# Altium schematic sheet 06-Si5341_PLL.SchDoc
size B; SheetNumber: 6; SheetTotal: 12
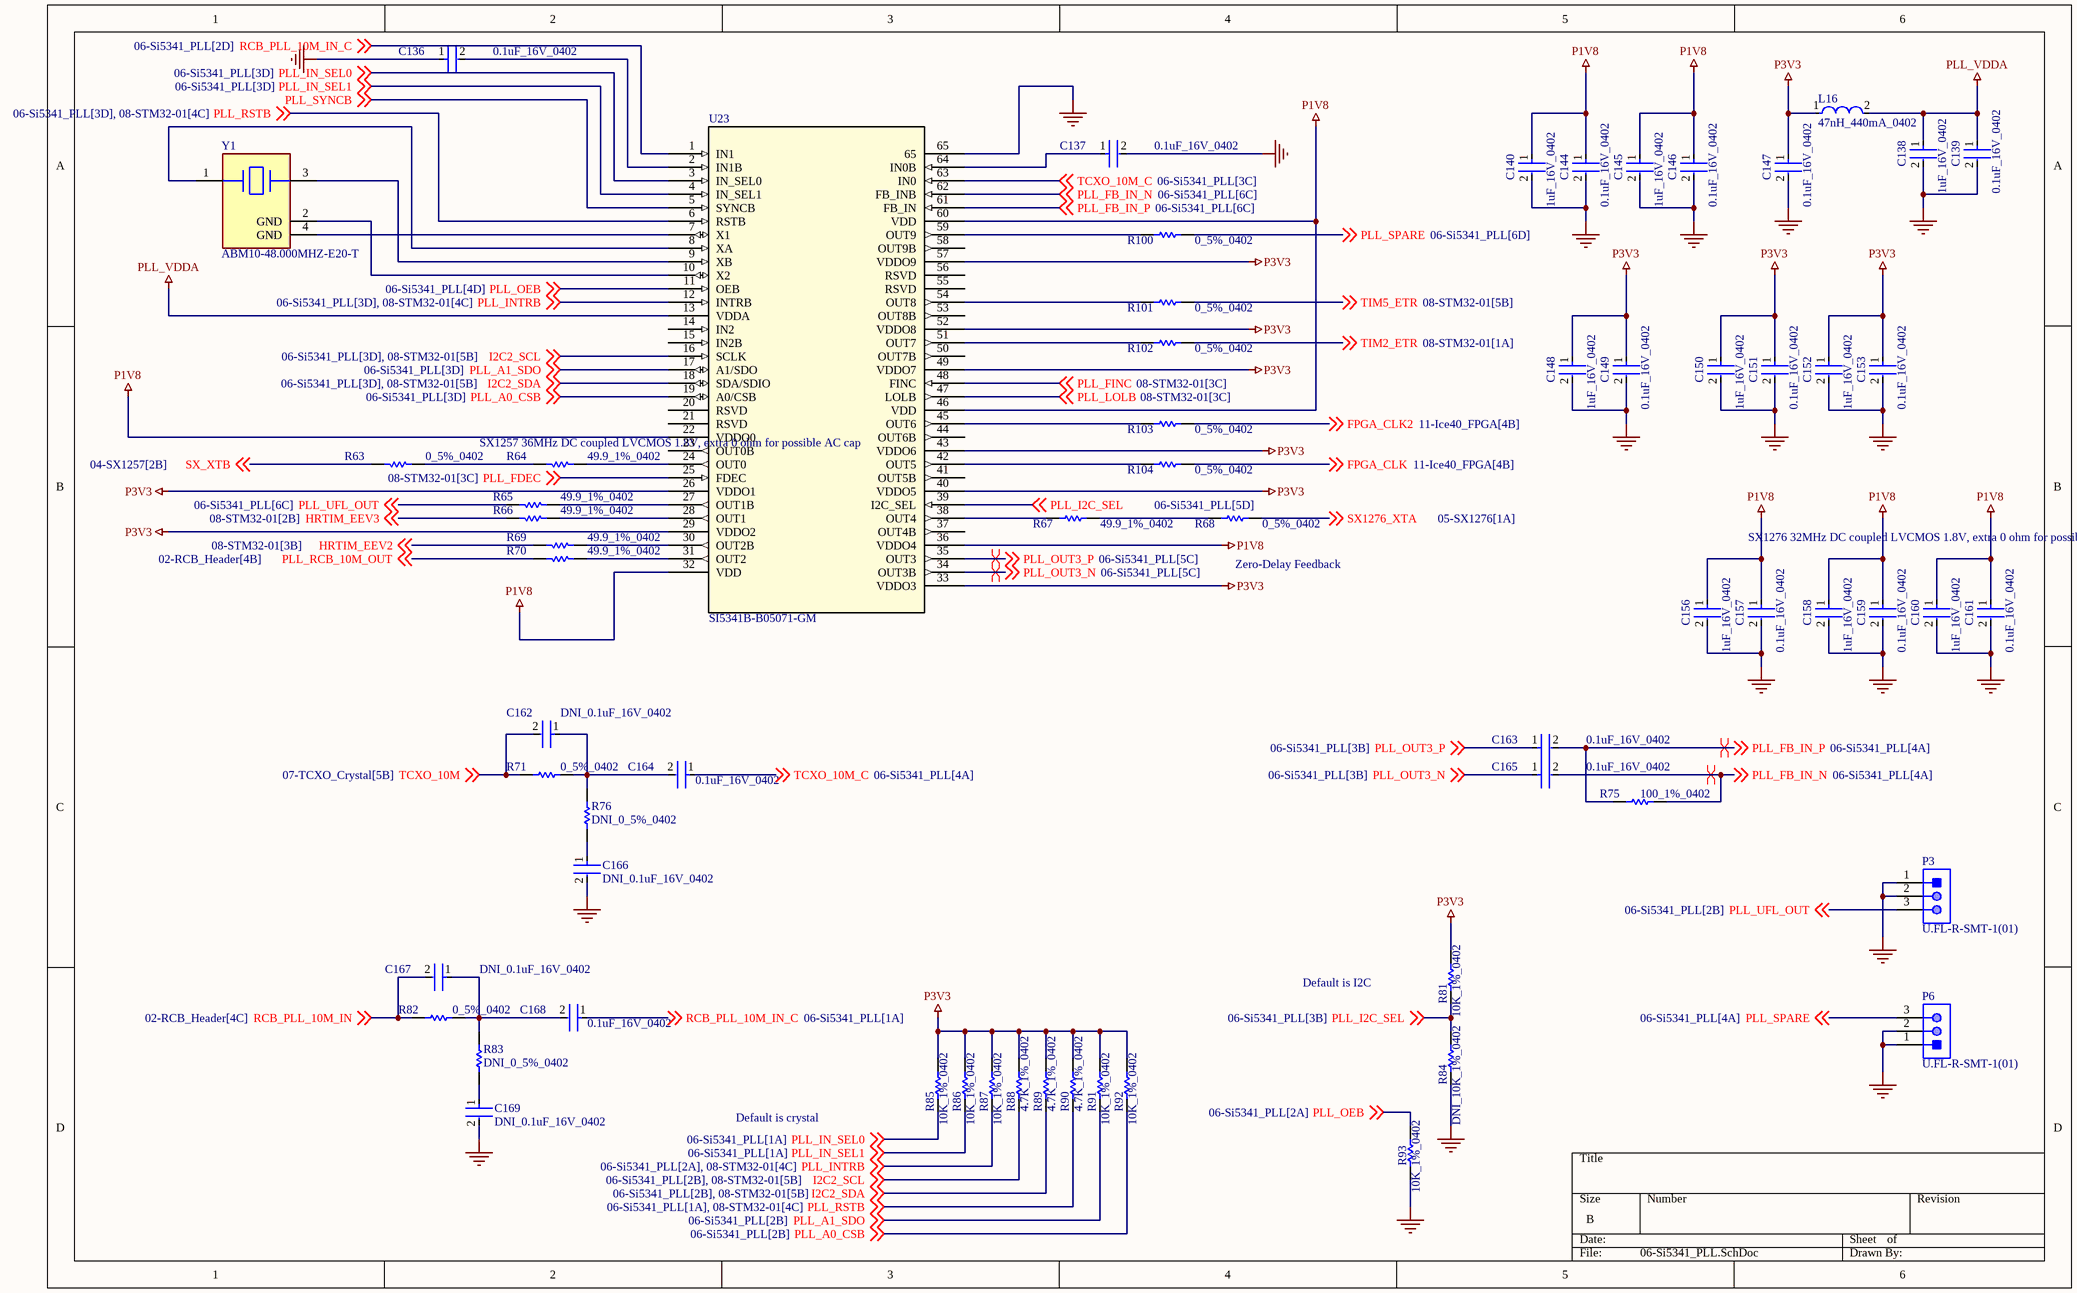
[diagram p0: 06-Si5341_PLL.SchDoc]

## Parts
C136  0.1uF_16V_0402  [FP-C0402-BB-MFG]
C137  0.1uF_16V_0402  [FP-C0402-BB-MFG]
C138  1uF_16V_0402  [FP-0402-L_1_0_0_05-W_0_5-IPC_A]
C139  0.1uF_16V_0402  [FP-C0402-BB-MFG]
C140  1uF_16V_0402  [FP-0402-L_1_0_0_05-W_0_5-IPC_A]
C144  0.1uF_16V_0402  [FP-C0402-BB-MFG]
C145  1uF_16V_0402  [FP-0402-L_1_0_0_05-W_0_5-IPC_A]
C146  0.1uF_16V_0402  [FP-C0402-BB-MFG]
C147  0.1uF_16V_0402  [FP-C0402-BB-MFG]
C148  1uF_16V_0402  [FP-0402-L_1_0_0_05-W_0_5-IPC_A]
C149  0.1uF_16V_0402  [FP-C0402-BB-MFG]
C150  1uF_16V_0402  [FP-0402-L_1_0_0_05-W_0_5-IPC_A]
C151  0.1uF_16V_0402  [FP-C0402-BB-MFG]
C152  1uF_16V_0402  [FP-0402-L_1_0_0_05-W_0_5-IPC_A]
C153  0.1uF_16V_0402  [FP-C0402-BB-MFG]
C156  1uF_16V_0402  [FP-0402-L_1_0_0_05-W_0_5-IPC_A]
C157  0.1uF_16V_0402  [FP-C0402-BB-MFG]
C158  1uF_16V_0402  [FP-0402-L_1_0_0_05-W_0_5-IPC_A]
C159  0.1uF_16V_0402  [FP-C0402-BB-MFG]
C160  1uF_16V_0402  [FP-0402-L_1_0_0_05-W_0_5-IPC_A]
C161  0.1uF_16V_0402  [FP-C0402-BB-MFG]
C162  DNI_0.1uF_16V_0402  [FP-C0402-BB-MFG]  (no BOM)
C163  0.1uF_16V_0402  [FP-C0402-BB-MFG]
C164  0.1uF_16V_0402  [FP-C0402-BB-MFG]
C165  0.1uF_16V_0402  [FP-C0402-BB-MFG]
C166  DNI_0.1uF_16V_0402  [FP-C0402-BB-MFG]  (no BOM)
C167  DNI_0.1uF_16V_0402  [FP-C0402-BB-MFG]  (no BOM)
C168  0.1uF_16V_0402  [FP-C0402-BB-MFG]
C169  DNI_0.1uF_16V_0402  [FP-C0402-BB-MFG]  (no BOM)
L16  47nH_440mA_0402  [FP-LQW15AN_80-MFG]
P3  U.FL-R-SMT-1(01)  [HRS-U.FL-R-SMT-3_V]
P6  U.FL-R-SMT-1(01)  [HRS-U.FL-R-SMT-3_V]
R63  0_5%_0402  [RESC1005X40X25NL05T10]
R64  49.9_1%_0402  [RESC1005X40X25NL10T10]
R65  49.9_1%_0402  [RESC1005X40X25NL10T10]
R66  49.9_1%_0402  [RESC1005X40X25NL10T10]
R67  49.9_1%_0402  [RESC1005X40X25NL10T10]
R68  0_5%_0402  [RESC1005X40X25NL05T10]
R69  49.9_1%_0402  [RESC1005X40X25NL10T10]
R70  49.9_1%_0402  [RESC1005X40X25NL10T10]
R71  0_5%_0402  [RESC1005X40X25NL05T10]
R75  100_1%_0402  [RESC1005X40X25NL05T10]
R76  DNI_0_5%_0402  [RESC1005X40X25NL05T10]  (no BOM)
R81  10K_1%_0402  [RESC1005X40X25NL10T10]
R82  0_5%_0402  [RESC1005X40X25NL05T10]
R83  DNI_0_5%_0402  [RESC1005X40X25NL05T10]  (no BOM)
R84  DNI_10K_1%_0402  [RESC1005X40X25NL10T10]  (no BOM)
R85  10K_1%_0402  [RESC1005X40X25NL10T10]
R86  10K_1%_0402  [RESC1005X40X25NL10T10]
R87  10K_1%_0402  [RESC1005X40X25NL10T10]
R88  4.7K_1%_0402  [RESC1005X40X25NL10T10]
R89  4.7K_1%_0402  [RESC1005X40X25NL10T10]
R90  4.7K_1%_0402  [RESC1005X40X25NL10T10]
R91  10K_1%_0402  [RESC1005X40X25NL10T10]
R92  10K_1%_0402  [RESC1005X40X25NL10T10]
R93  10K_1%_0402  [RESC1005X40X25NL10T10]
R100  0_5%_0402  [RESC1005X40X25NL05T10]
R101  0_5%_0402  [RESC1005X40X25NL05T10]
R102  0_5%_0402  [RESC1005X40X25NL05T10]
R103  0_5%_0402  [RESC1005X40X25NL05T10]
R104  0_5%_0402  [RESC1005X40X25NL05T10]
U23  SI5341B-B05071-GM  [QFN64_SI5341_SIL_SKY]
Y1  ABM10-48.000MHZ-E20-T  [FP-ABM10-MFG]

## Nets
GND: C136.1 C137.2 C138.2 C139.2 C140.2 C144.2 C145.2 C146.2 C147.2 C148.2 C149.2 C150.2 C151.2 C152.2 C153.2 C156.2 C157.2 C158.2 C159.2 C160.2 C161.2 C166.2 C169.2 P3.1 P3.2 P6.1 P6.2 R84.1 R93.1 U23.65
P1V8: C140.1 C144.1 C145.1 C146.1 C156.1 C157.1 C158.1 C159.1 C160.1 C161.1 U23.22(VDDO0) U23.32(VDD) U23.36(VDDO4) U23.46(VDD) U23.60(VDD)
P3V3: C147.1 C148.1 C149.1 C150.1 C151.1 C152.1 C153.1 L16.1 R81.2 R85.2 R86.2 R87.2 R88.2 R89.2 R90.2 R91.2 R92.2 U23.26(VDDO1) U23.29(VDDO2) U23.33(VDDO3) U23.40(VDDO5) U23.43(VDDO6) U23.49(VDDO7) U23.52(VDDO8) U23.57(VDDO9)
PLL_VDDA: C138.1 C139.1 L16.2 U23.13(VDDA)
FPGA_CLK: R104.2 ; off-sheet FPGA_CLK
FPGA_CLK2: R103.2 ; off-sheet FPGA_CLK2
HRTIM_EEV2: R69.1 ; off-sheet HRTIM_EEV2
HRTIM_EEV3: R66.1 ; off-sheet HRTIM_EEV3
I2C2_SCL: R88.1 U23.16(SCLK) ; off-sheet I2C2_SCL
I2C2_SDA: R89.1 U23.18(SDA/SDIO) ; off-sheet I2C2_SDA
PLL_A0_CSB: R92.1 U23.19(A0/CSB) ; off-sheet PLL_A0_CSB
PLL_A1_SDO: R91.1 U23.17(A1/SDO) ; off-sheet PLL_A1_SDO
PLL_FB_IN_N: C165.2 R75.2 U23.62(FB_INB) ; off-sheet PLL_FB_IN_N
PLL_FB_IN_P: C163.2 R75.1 U23.61(FB_IN) ; off-sheet PLL_FB_IN_P
PLL_FDEC: U23.25(FDEC) ; off-sheet PLL_FDEC
PLL_FINC: U23.48(FINC) ; off-sheet PLL_FINC
PLL_I2C_SEL: R81.1 R84.2 U23.39(I2C_SEL) ; off-sheet PLL_I2C_SEL
PLL_IN_SEL0: R85.1 U23.3(IN_SEL0) ; off-sheet PLL_IN_SEL0
PLL_IN_SEL1: R86.1 U23.4(IN_SEL1) ; off-sheet PLL_IN_SEL1
PLL_INTRB: R87.1 U23.12(INTRB) ; off-sheet PLL_INTRB
PLL_LOLB: U23.47(LOLB) ; off-sheet PLL_LOLB
PLL_OEB: R93.2 U23.11(OEB) ; off-sheet PLL_OEB
PLL_OUT3_N: C165.1 U23.34(OUT3B) ; off-sheet PLL_OUT3_N
PLL_OUT3_P: C163.1 U23.35(OUT3) ; off-sheet PLL_OUT3_P
PLL_RCB_10M_OUT: R70.1 ; off-sheet PLL_RCB_10M_OUT
PLL_RSTB: R90.1 U23.6(RSTB) ; off-sheet PLL_RSTB
PLL_SPARE: P6.3 R100.2 ; off-sheet PLL_SPARE
PLL_SYNCB: U23.5(SYNCB) ; off-sheet PLL_SYNCB
PLL_UFL_OUT: P3.3 R65.1 ; off-sheet PLL_UFL_OUT
RCB_PLL_10M_IN: C167.2 R82.1 ; off-sheet RCB_PLL_10M_IN
RCB_PLL_10M_IN_C: C168.1 U23.1(IN1) ; off-sheet RCB_PLL_10M_IN_C
SX1276_XTA: R68.2 ; off-sheet SX1276_XTA
SX_XTB: R63.2 ; off-sheet SX_XTB
TCXO_10M: C162.2 R71.1 ; off-sheet TCXO_10M
TCXO_10M_C: C164.1 U23.63(IN0) ; off-sheet TCXO_10M_C
TIM2_ETR: R102.2 ; off-sheet TIM2_ETR
TIM5_ETR: R101.2 ; off-sheet TIM5_ETR
NetC136_2: C136.2 U23.2(IN1B)
NetC137_1: C137.1 U23.64(IN0B)
NetC162_1: C162.1 C164.2 R71.2 R76.2
NetC166_1: C166.1 R76.1
NetC167_1: C167.1 C168.2 R82.2 R83.2
NetC169_1: C169.1 R83.1
NetR63_1: R63.1 R64.1
NetR64_2: R64.2 U23.24(OUT0)
NetR65_2: R65.2 U23.27(OUT1B)
NetR66_2: R66.2 U23.28(OUT1)
NetR67_1: R67.1 R68.1
NetR67_2: R67.2 U23.38(OUT4)
NetR69_2: R69.2 U23.30(OUT2B)
NetR70_2: R70.2 U23.31(OUT2)
NetR100_1: R100.1 U23.59(OUT9)
NetR101_1: R101.1 U23.54(OUT8)
NetR102_1: R102.1 U23.51(OUT7)
NetR103_1: R103.1 U23.45(OUT6)
NetR104_1: R104.1 U23.42(OUT5)
NetU23_7: U23.7(X1) Y1.4(GND)
NetU23_8: U23.8(XA) Y1.1
NetU23_9: U23.9(XB) Y1.3
NetU23_10: U23.10(X2) Y1.2(GND)

Not connected (* = marked no-connect by the designer): U23 14(IN2) 15(IN2B) 20(RSVD) 21(RSVD) 23(OUT0B) 37(OUT4B) 41(OUT5B) 44(OUT6B) 50(OUT7B) 53(OUT8B) 55(RSVD) 56(RSVD) 58(OUT9B)

## Layout directives
differential pair: PLL_FB_IN_N, PLL_FB_IN_P, PLL_OUT3_N, PLL_OUT3_P

## Notes on the sheet
- (near R63) SX1257 36MHz DC coupled LVCMOS 1.8V, extra 0 ohm for possible AC cap
- (near R68) Zero-Delay Feedback
- SX1276 32MHz DC coupled LVCMOS 1.8V, extra 0 ohm for possible AC cap
- Default is I2C
- Default is crystal

## Library data of the parts
C136 C137 C139 C144 C146 C147 C149 C151 C153 C157 C159 C161-C169 = CMP-1034-02068-3: CAP CER 0.1UF 16V 5% X7R 0402; Manufacturer: Kemet; Manufacturer Part Number: C0402C104J4RACTU; Value: 0.10 μF; Temperature Coefficient: 15%; Tolerance: 0.05; Material: Ceramic; ComponentLink2URL: https://content.kemet.com/datasheets/KEM_C1002_X7R_SMD.pdf; Automotive: No; Device Class L2: Capacitors; Temperature: -55°C to +125°C; RoHS: TRUE; Voltage Rating: 16 V; ComponentLink2Description: Datasheet; Device Class L3: Ceramic Capacitors; Temperature Range Low: -55°C; Ipc Land Pattern Name: CAPC10050X50; Device Class L1: Passive Components; Temperature Range High: +125°C; Package: C0402-BB; Capacitance: 0.10 μF; Category: Cap; Mouser Description: CAP CER 0.1UF 16V X7R 0402; Height: 0.55mm; Digikey Description: CAP CER 0.1UF 16V 5% X7R 0402; Octopart: https://octopart.com/c0402c104j4ractu-kemet-12573893; Temperature Characteristic: X7R; Lead Free: Yes
C138 C140 C145 C148 C150 C152 C156 C158 C160 = CMP-14477-000104-2: None; Tolerance: 10%; Voltage Rating: 16V; Dielectric: X5R; Capacitance: 1uF; Packaging: Tape and Reel; Depth: 0.5mm; Mount: Surface Mount; Thickness: 0.022inch; Package Quantity: 1; Min Operating Temperature: -55°C; Series: M; Voltage Rating (DC): 16V; Termination: SMD/SMT; Case/Package: 0402; Number of Pins: 2; Case Code (Imperial): 0402; Length: 1mm; Halogen Free: Halogen Free; Case Code (Metric): 1005; Width: 0.02inch; RoHS Compliant: Yes; Radiation Hardening: No; Max Operating Temperature: 85°C; Height: 0.5mm; Construction: Flat
L16 = CMP-06042-005115-1: Wire Wound RF Inductor 47nH ±5% 440mA 0.648Ω 0402 (1005); Shielding: Unshielded; Core Material: Non-Magnetic; Test Frequency: 100MHz; Q Factor: 25; DC Resistance (DCR): 648mR; Self Resonant Frequency: 3.2GHz; Width: 0.024inch; Packaging: Tape and Reel; Mount: Surface Mount; Resistor Type: Wirewound; Termination: SMD/SMT; Tolerance: 5%; Case Code (Metric): 1005; Min Operating Temperature: -55°C; Current Rating: 440mA; Height: 0.5mm; Max Operating Temperature: 125°C; Case/Package: 0402; Height - Seated (Max): 0.024inch; Length: 0.039inch; Inductance: 47nH; Case Code (Imperial): 0402; Max DC Current: 440mA; Package Quantity: 1
P3 P6 = CMP-2000-05153-1: Ultra Small Coaxial Connector, 6 GHz, -40 to 90 degC, 3-Pin SMD, RoHS, Bulk; Manufacturer: Hirose Electric; Connector Style: U.FL; Impedance: 50Ohm; Dielectric Material: LiquidCrystalPolymer(LCP); Minimum Quantity: UltraMiniatureCoaxial; Online Catalog: U.FLSeries; Featured Product: HiroseU.FLSeries; Frequency - Max: 6GHz; Other Names: H122041 / U.FL-R-SMT-1(01)-ND; Contact Termination: Solder; Body Material: PhosphorBronze; Connector Type: Jack,MalePin; Body Finish: Silver; Center Contact Plating: Gold; Manufacturer URL: https://www.hirose.com; Family: CoaxialConnectors(RF); Fastening Type: Snap-On; Unit PriceUSD: U.FL; Series: U.FL; Package Reference: U.FL-R-SMT; Packaging: Bulk; Standard Package: 100; Mounting Type: SurfaceMount; Quantity Available: Bulk; Housing Color: Silver; Package Description: 3-Pin Surface Mount Device, Body 2.6 x 2.6 mm; Category: Connectors,Interconnects; Operating Temperature: -40degC~90degC; Center Contact Material: PhosphorBronze; Dynamic Catalog: U.FLSeries; Datasheet URL: https://datasheet.ciiva.com/26945/getdatasheetpartid-475239-26945414.pdf; Datasheet Version: Feb-09; Shield Termination: Solder
R63 R68 R71 R76 R82 R83 R100-R104 = CMP-2002-06457-1: Manufacturer: Panasonic; Part Number: ERJ-U020R00X
R64-R67 R69 R70 = CMP-2002-04448-1: Part Number: RK73H1ETTP49R9F; Manufacturer: KOA Speer
R75 = CMP-2002-07853-1: Manufacturer: Yageo; Part Number: RC0402FR-13100RL
R81 R84-R87 R91-R93 = CMP-2002-04694-1: Manufacturer: Bourns; Part Number: CR0402-FX-1002GLF
R88-R90 = CMP-2002-05217-1: Manufacturer: Bourns; Part Number: CR0402-FX-4701GLF
U23 = SI5341B-B05071-GM: No Description Available; Mfr_Name: Skyworks; Type: DEV; Copyright: Copyright (C) 2023 Ultra Librarian. All rights reserved.; Manufacturer_Part_Number: SI5341B-B05071-GM; RefDes: RefDes
Y1 = CMP-27762-011866-1: Crystal 48MHz ±20ppm 10pF SMD-4 2.5mm x 2mm; ESR (Equivalent Series Resistance): 70R; Frequency Tolerance: 20ppm; Depth: 2mm; Height: 0.02inch; RoHS Compliant: Yes; Lead Free: Lead Free; Case/Package: CSMD; Tolerance: 20ppm; Operating Frequency: 48 MHz; Load Capacitance: 10pF; Package Quantity: 1000; Mount: Surface Mount; Number of Pins: 4; Frequency: 48MHz; Length: 2.5mm; Series Resistance: 70R; Packaging: Tape and Reel; Min Operating Temperature: -20°C; Max Operating Temperature: 70°C; Termination: SMD/SMT; Width: 0.079inch; Frequency Stability: 20ppm; Series: ABM10